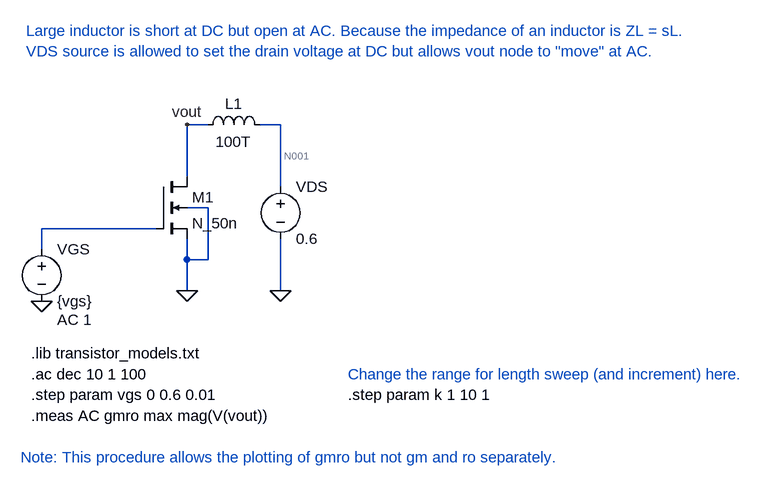
[diagram p0: schematic lab07_gmro_extract.asc]
lab07_gmro_extract.asc, the LTspice schematic file:
Version 4
SHEET 1 1100 680
WIRE -64 -64 -96 -64
WIRE 48 -64 16 -64
WIRE -96 16 -96 -64
WIRE 48 32 48 -64
WIRE -64 64 -96 64
WIRE -144 96 -320 96
WIRE -320 128 -320 96
WIRE -96 144 -96 112
WIRE -64 144 -64 64
WIRE -64 144 -96 144
WIRE -96 192 -96 144
WIRE 48 192 48 112
FLAG -96 192 0
FLAG 48 192 0
FLAG -320 208 0
FLAG -96 -64 vout
SYMBOL voltage 48 16 R0
WINDOW 123 0 0 Left 0
WINDOW 39 0 0 Left 0
SYMATTR InstName VDS
SYMATTR Value 0.6
SYMBOL voltage -320 112 R0
WINDOW 123 24 124 Left 2
WINDOW 39 0 0 Left 0
SYMATTR Value2 AC 1
SYMATTR InstName VGS
SYMATTR Value {vgs}
SYMBOL nmos4 -144 16 R0
SYMATTR InstName M1
SYMATTR Value N_50n
SYMATTR Value2 l={500n*k} w=500n
SYMBOL ind -80 -48 R270
WINDOW 0 32 56 VTop 2
WINDOW 3 5 56 VBottom 2
SYMATTR InstName L1
SYMATTR Value 100T
TEXT -336 288 Left 2 !.lib transistor_models.txt
TEXT -336 320 Left 2 !.ac dec 10 1 100
TEXT -336 384 Left 2 !.meas AC gmro max mag(V(vout))
TEXT -344 -208 Left 2 ;Large inductor is short at DC but open at AC. Because the impedance of an inductor is ZL = sL.\nVDS source is allowed to set the drain voltage at DC but allows vout node to "move" at AC.
TEXT -352 448 Left 2 ;Note: This procedure allows the plotting of gmro but not gm and ro separately.
TEXT -336 352 Left 2 !.step param vgs 0 0.6 0.01
TEXT 152 352 Left 2 !.step param k 1 10 1
TEXT 152 320 Left 2 ;Change the range for length sweep (and increment) here.

The netlist it stands for:
* lab07_gmro_extract.asc
VDS N001 0 0.6
VGS N002 0 {vgs} AC 1
M1 vout N002 0 0 N_50n l={500n*k} w=500n
L1 vout N001 100T
.model NMOS NMOS
.model PMOS PMOS
.lib standard.mos
.lib transistor_models.txt
.ac dec 10 1 100
.meas AC gmro max mag(V(vout))
* Large inductor is short at DC but open at AC. Because the impedance of an inductor is ZL = sL.
* VDS source is allowed to set the drain voltage at DC but allows vout node to "move" at AC.
* Note: This procedure allows the plotting of gmro but not gm and ro separately.
.step param vgs 0 0.6 0.01
.step param k 1 10 1
* Change the range for length sweep (and increment) here.
.backanno
.end

* Results of the author's LTspice run, read from the files saved beside the schematic
* Operating Point (first step), zero values left out:
*   V(n001) = 600 mV
*   V(vout) = 600 mV
*   Id(M1) = 1.953 nA
*   Ig(M1) = -72.04 pA
*   Is(M1) = -1.88 nA
*   I(L1) = -1.953 nA
*   I(Vgs) = 72.04 pA
*   I(Vds) = -1.953 nA
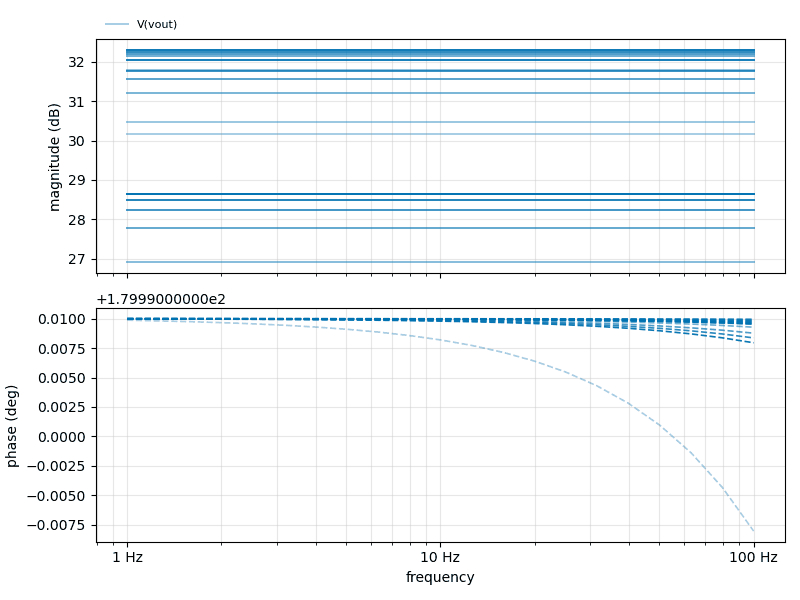
[diagram p1: AC Analysis of lab07_gmro_extract.asc, plotted from the saved traces]
* AC Analysis, 610 runs:
*   V(vout) [run 1]: 30.17 dB at 1 Hz, 30.17 dB at 100 Hz, peak 30.17 dB at 1 Hz
*   V(vout) [run 2]: 30.48 dB at 1 Hz, 30.48 dB at 100 Hz, peak 30.48 dB at 1 Hz
*   V(vout) [run 3]: 31.79 dB at 1 Hz, 31.79 dB at 100 Hz, peak 31.79 dB at 1 Hz
*   V(vout) [run 4]: 26.91 dB at 1 Hz, 26.91 dB at 100 Hz, peak 26.91 dB at 1 Hz
*   V(vout) [run 5]: 31.21 dB at 1 Hz, 31.21 dB at 100 Hz, peak 31.21 dB at 1 Hz
*   V(vout) [run 6]: 32.14 dB at 1 Hz, 32.14 dB at 100 Hz, peak 32.14 dB at 1 Hz
*   V(vout) [run 7]: 27.79 dB at 1 Hz, 27.79 dB at 100 Hz, peak 27.79 dB at 1 Hz
*   V(vout) [run 8]: 31.57 dB at 1 Hz, 31.57 dB at 100 Hz, peak 31.57 dB at 1 Hz